# Altium schematic sheet PowerSys.SchDoc: Power Regulation
size A4; Revision: 2.2
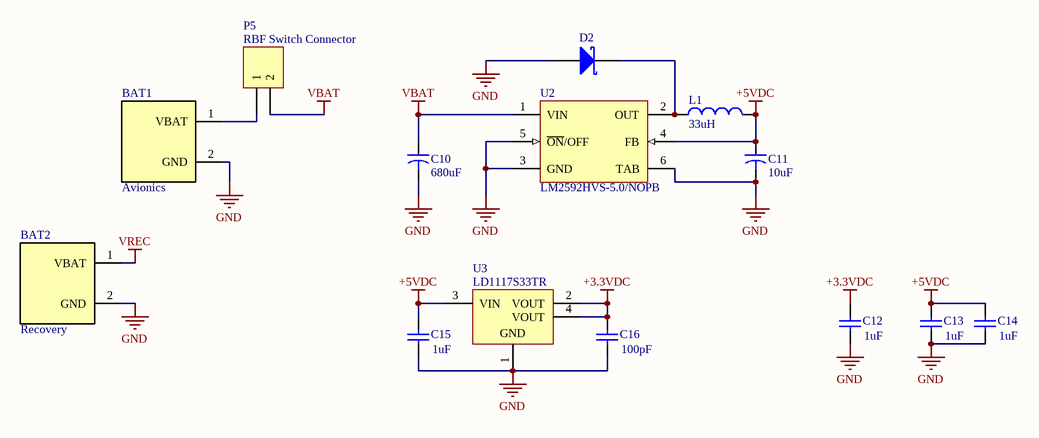
[diagram p0: PowerSys.SchDoc]

## Parts
BAT1  Avionics  [XT30]
BAT2  Recovery  [XT30]
C10  value 680uF  [*CAPAE430X550N]  (hidden comment: Cap2)
C11  value 10uF  [*CAPAE430X550N]  (hidden comment: Cap2)
C12  value 1uF  [1608[0603]]  (hidden comment: Cap Semi)
C13  value 1uF  [1608[0603]]  (hidden comment: Cap Semi)
C14  value 1uF  [1608[0603]]  (hidden comment: Cap Semi)
C15  value 1uF  [C1206]  (hidden comment: Cap Semi)
C16  value 100pF  [C1206]  (hidden comment: Cap Semi)
D2  D Schottky  [SMB]  (value not drawn)
L1  33uH  [Inductor]
P5  RBF Switch Connector  [HDR1X2]
U2  LM2592HVS-5.0/NOPB  [TS5B_N]
U3  LD1117S33TR  [SOT-223_N]

## Nets
+3.3VDC: C12.2 C16.2 U3.2(VOUT) U3.4(VOUT)
+5VDC: C11.1 C13.2 C14.2 C15.2 L1.1 U2.4(FB) U3.3(VIN)
GND: BAT1.2(GND) BAT2.2(GND) C10.2 C11.2 C12.1 C13.1 C14.1 C15.1 C16.1 D2.1(A) U2.3(GND) U2.5(~{ON}/OFF) U2.6(TAB) U3.1(GND)
VBAT: C10.1 P5.2 U2.1(VIN)
VREC: BAT2.1(VBAT)
NetBAT1_1: BAT1.1(VBAT) P5.1
NetD2_2: D2.2(K) L1.2 U2.2(OUT)

## Library data of the parts
BAT1 BAT2 = XT30
C10 C11 = Cap2: Capacitor; Published: 23-Sep-2002; PackageReference: CAPR5-4X5; Publisher: Altium Limited; PackageDescription: Capacitor; 2 Leads
C12-C16 = Cap Semi: Capacitor (Semiconductor SIM Model); Published: 8-Jun-2000; LatestRevisionDate: 29-May-2009; LatestRevisionNote: IPC-7351 Footprint Added.; PackageReference: C1206; Publisher: Altium Limited; PackageDescription: Chip Capacitor
D2 = D Schottky: Schottky Diode; Published: 8-Jun-2000; LatestRevisionDate: 17-Jul-2002; LatestRevisionNote: Re-released for DXP Platform.; PackageReference: SMB; Publisher: Altium Limited; PackageDescription: DO-214-AA/SMB; 2 C-Bend Leads; Body 5.3 x 3.6 mm, inc. leads (LxW); Code_JEDEC: DO-214-AA
L1 = Inductor
P5 = Header 2: Header, 2-Pin; LatestRevisionDate: 17-Jul-2002; LatestRevisionNote: Re-released for DXP Platform.; Publisher: Altium Limited
U2 = LM2592HVS-5.0/NOPB: SIMPLE SWITCHER® Power Converter 150 KHz 2A Step-Down Voltage Regulator, 5-pin TO-263, Pb-Free; Manufacturer: National Semiconductor; PackageTopMarking: NSUZXYTTE#*LM2592HVS*-5.0 P+; PowerWise: N; Published: 1-Mar-2010; DatasheetVersion: Aug-2001; PackageVersion: revD, Apr-2005; PackageReference: TS5B; Publisher: Altium Limited; PackageDescription: TO-263, Molded, .400 x .390 x .180in, 5 Lead, .067in Pitch, Surface Mount; Supplier 1: Digi-Key; Supplier Part Number 1: LM2592HVS-5.0-ND; Supplier 2: Farnell; Supplier Part Number 2: 1469187; PartNumber: LM2592HVS-5.0/NOPB; RoHS: Y; PinCount: 5; CompType: Switcher; Code_JEDEC: MO-169-AB; ComponentLink1Description: LM2592HV Datasheet; ComponentLink1URL: http://www.national.com/ds/LM/LM2592HV.pdf; ComponentLink2Description: LM2592HV Web Page; ComponentLink2URL: http://www.national.com/pf/LM/LM2592HV.html; ComponentLink3Description: TS5B Package Page; ComponentLink3URL: http://www.national.com/packaging/folders/ts5b.html
U3 = LD1117S33TR: Fixed Low Drop Positive Voltage Regulator, 3.3V, 4-Pin SOT-223, Tape and Reel; DatasheetVersion: Nov-2011; PackageVersion: 2010; PackageReference: SOT-223; PackageDescription: 4-Pin SOT-223 Package, 6.5 x 3.5 mm Body, 2.3 mm Pitch, 7 mm Lead Span; PartNumber: LD1117S33TR; ComponentLink1Description: Manufacturer URL; ComponentLink1URL: http://www.st.com; ComponentLink2Description: Datasheet; ComponentLink2URL: http://www.st.com/internet/com/TECHNICAL_RESOURCES/TECHNICAL_LITERATURE/DATASHEET/CD00000544.pdf